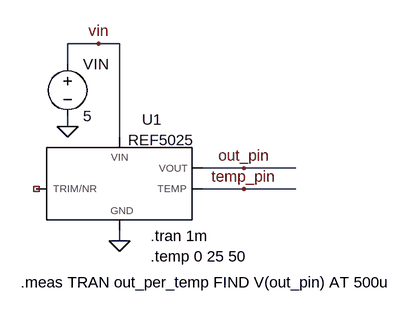
[diagram p0: schematic 01-REF5025_transient_analysis.asc]
01-REF5025_transient_analysis.asc, the LTspice schematic file:
Version 4
SHEET 1 880 680
WIRE 112 -48 64 -48
WIRE 144 -48 112 -48
WIRE 64 -16 64 -48
WIRE 64 80 64 64
WIRE 144 96 144 -48
WIRE 336 144 272 144
WIRE 416 144 336 144
WIRE 336 176 272 176
WIRE 416 176 336 176
WIRE 144 256 144 240
FLAG 144 256 0
FLAG 64 80 0
FLAG 336 144 out_pin
FLAG 336 176 temp_pin
FLAG 112 -48 vin
SYMBOL REF5025 160 176 R0
SYMATTR InstName U1
SYMBOL voltage 64 -32 R0
SYMATTR InstName VIN
SYMATTR Value 5
TEXT 192 248 Left 2 !.tran 1m
TEXT 192 280 Left 2 !.temp 0 25 50
TEXT -8 320 Left 2 !.meas TRAN out_per_temp FIND V(out_pin) AT 500u

The netlist it stands for:
* 01-REF5025_transient_analysis.asc
XU1 vin temp_pin 0 NC_01 out_pin REF5025  ; pins 2 3 4 5 6
VIN vin 0 5
.tran 1m
.temp 0 25 50
.meas TRAN out_per_temp FIND V(out_pin) AT 500u
.lib REF5025.LIB
.backanno
.end

* Results of the author's LTspice run, read from the files saved beside the schematic
* Operating Point (first step), zero values left out:
*   V(out_pin) = 2.501 V
*   V(vin) = 5 V
*   V(temp_pin) = 504.3 mV
*   I(Vin) = -753.8 µA
*   Ix(u1:2) = 753.8 µA
*   Ix(u1:4) = -668.1 µA
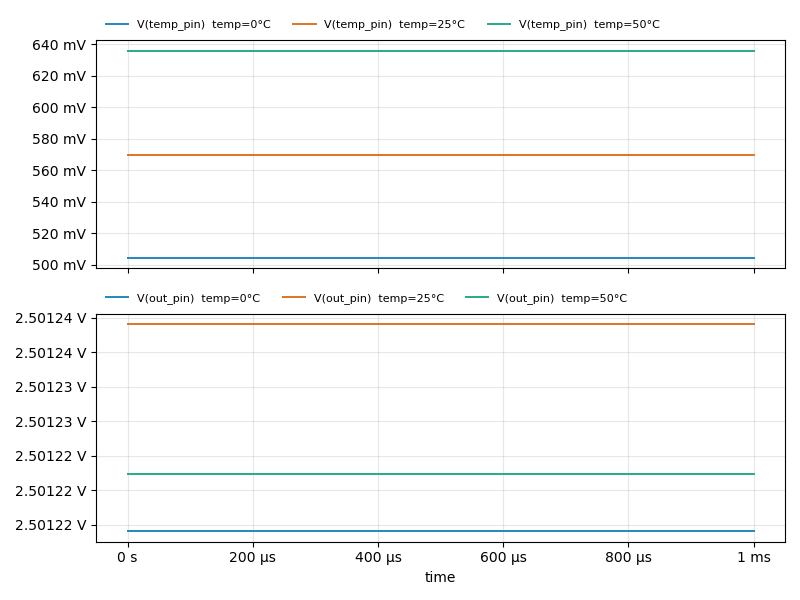
[diagram p1: Transient Analysis of 01-REF5025_transient_analysis.asc, plotted from the saved traces]
* Transient Analysis, 3 runs:
*   V(temp_pin) [temp=0°C]: min 504.3 mV, max 504.3 mV, average 504.3 mV, rms 504.3 mV, last 504.3 mV
*   V(temp_pin) [temp=25°C]: min 569.7 mV, max 569.7 mV, average 569.7 mV, rms 569.7 mV, last 569.7 mV
*   V(temp_pin) [temp=50°C]: min 635.9 mV, max 635.9 mV, average 635.9 mV, rms 635.9 mV, last 635.9 mV
*   V(out_pin) [temp=0°C]: min 2.501 V, max 2.501 V, average 2.501 V, rms 2.501 V, last 2.501 V
*   V(out_pin) [temp=25°C]: min 2.501 V, max 2.501 V, average 2.501 V, rms 2.501 V, last 2.501 V
*   V(out_pin) [temp=50°C]: min 2.501 V, max 2.501 V, average 2.501 V, rms 2.501 V, last 2.501 V
* From the log:
*   Measurement: out_per_temp
*     step  v(out_pin)  at
*        1  2.50121  0.0005
*        2  2.50124  0.0005
*        3  2.50122  0.0005